# Altium project power_board.PrjPcb
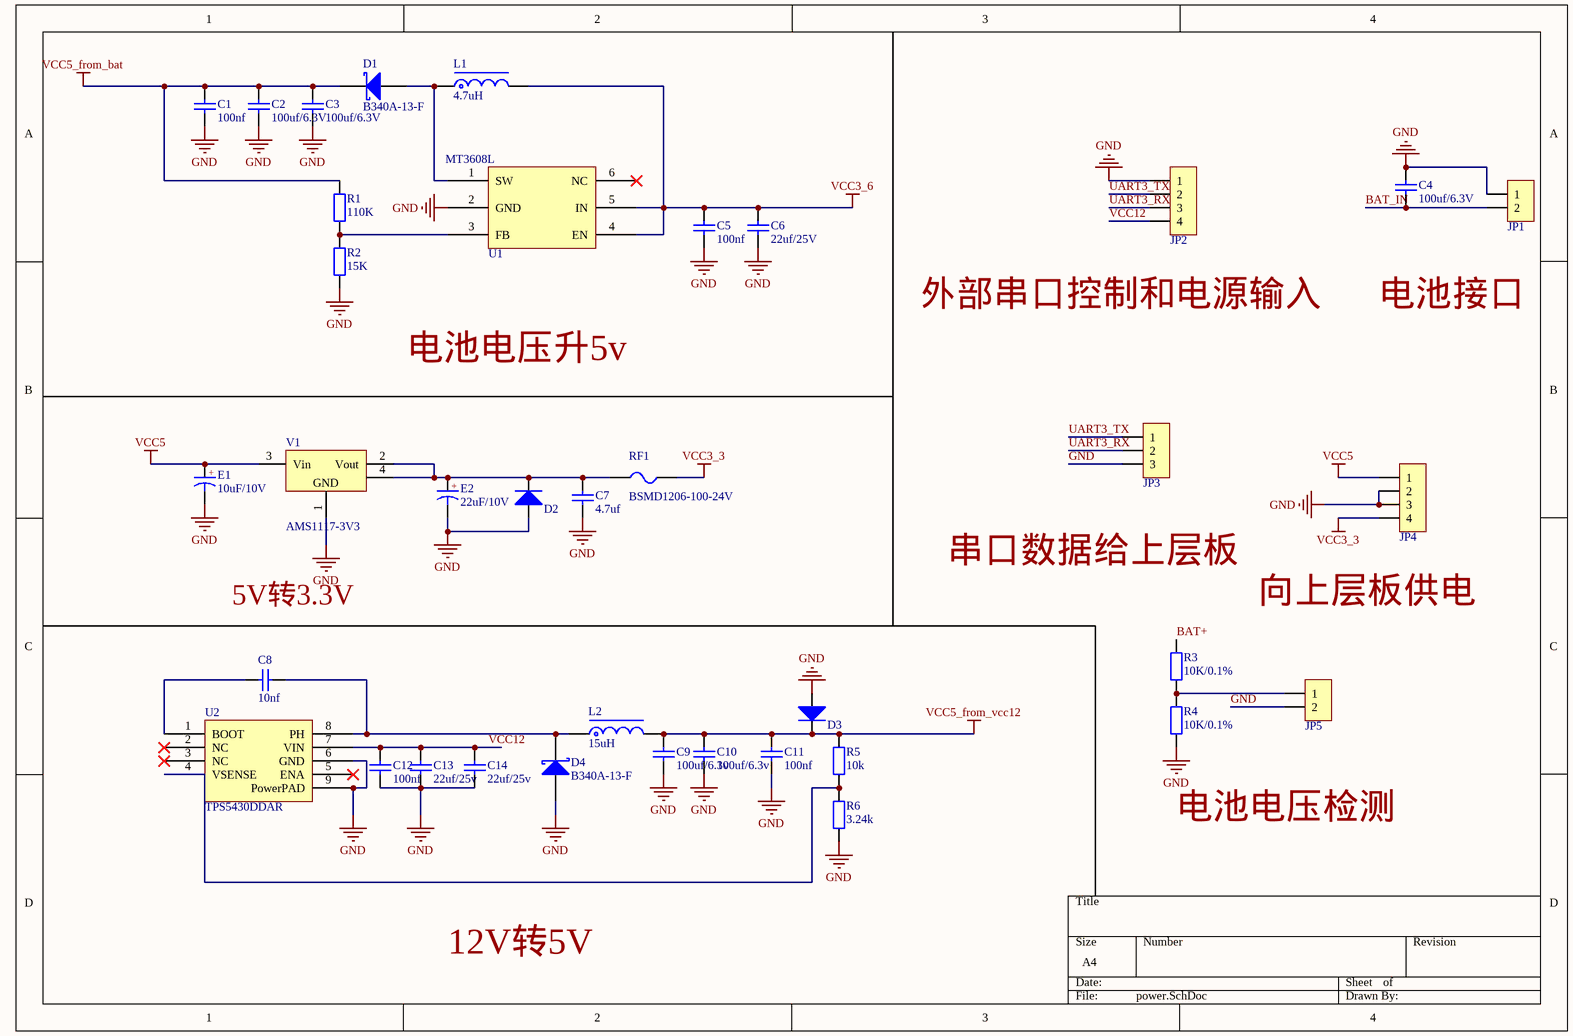
[diagram p0: power.SchDoc]
2 sheets, 73 parts. Net scope: global (net labels, ports and power ports of the same name join across sheets).
Board file: power.PcbDoc
Sheets:
  power.SchDoc
  power2.SchDoc

## Sheet power.SchDoc
size A4; SheetNumber: 1; SheetTotal: 2

### Parts
C1  100nf  [C0603_L]
C2  100uf/6.3V  [C1206_L]
C3  100uf/6.3V  [C1206_L]
C4  100uf/6.3V  [C1206_L]
C5  100nf  [C0603_L]
C6  22uf/25V  [C1206_L]
C7  4.7uf  [C0603_M]
C8  10nf  [C0603_L]
C9  100uf/6.3v  [C1206_L]
C10  100uf/6.3v  [C1206_L]
C11  100nf  [C0603_L]
C12  100nf  [C0603_L]
C13  22uf/25v  [C1206_L]
C14  22uf/25v  [C1206_L]
D1  B340A-13-F  [SMA]
D2  UDD32C03L01  [SOD-323]  (value not drawn)
D3  SMF5.0A  [SOD-123]  (value not drawn)
D4  B340A-13-F  [SMA]
E1  10uF/10V  [C_3216]
E2  22uF/10V  [C_3216]
JP1  HDR-1X2  [PH2.0-W-2P]  (value not drawn)
JP2  HDR-1X4  [PH2.0-W-4P]  (value not drawn)
JP3  HDR-1X3  [HDR2.54-LI-3P]  (value not drawn)
JP4  HDR-1X4  [HDR2.54-LI-4P]  (value not drawn)
JP5  HDR-1X2  [HDR2.54-LI-2P]  (value not drawn)
L1  4.7uH  [CD53]
L2  15uH  [CD75]
R1  110K  [R0603_L]
R2  15K  [R0603_L]
R3  10K/0.1%  [R0603_L]
R4  10K/0.1%  [R0603_L]
R5  10k  [R0603_L]
R6  3.24k  [R0603_L]
RF1  BSMD1206-100-24V  [F1206]
U1  MT3608L  [SOT23-6M]
U2  TPS5430DDAR  [SOIC-8_EP]
V1  AMS1117-3V3  [SOT223_L]

### Nets
GND: C1.1 C2.1 C3.1 C4.2 C5.1 C6.1 C7.2 C9.1 C10.1 C11.1 C12.1 C13.1 C14.1 D2.1(A) D3.1(A) D4.1(A) E1.2(K) E2.2(K) JP1.1 JP2.1 JP3.3 JP4.2 JP4.3 JP5.2 R2.1 R4.1 R6.1 U1.2(GND) U2.6(GND) U2.9(PowerPAD) V1.1(GND)
VCC3_3: JP4.4 RF1.1
VCC3_6: C5.2 C6.2 L1.2 U1.4(EN) U1.5(IN)
VCC5: E1.1(A) JP4.1 V1.3(Vin)
VCC5_from_bat: C1.2 C2.2 C3.2 D1.2(K) R1.2
VCC5_from_vcc12: C9.2 C10.2 C11.2 D3.2(K) L2.2 R5.2
VCC12: C12.2 C13.2 C14.2 JP2.4 U2.7(VIN)
BAT+: R3.2
BAT_IN: C4.1 JP1.2
UART3_RX: JP2.3 JP3.2
UART3_TX: JP2.2 JP3.1
NetC7_1: C7.1 D2.2(K) E2.1(A) RF1.2 V1.2(Vout) V1.4(GND)
NetC8_1: C8.1 U2.1(BOOT)
NetC8_2: C8.2 D4.2(K) L2.1 U2.8(PH)
NetD1_1: D1.1(A) L1.1 U1.1(SW)
NetJP5_1: JP5.1 R3.1 R4.2
NetR1_1: R1.1 R2.2 U1.3(FB)
NetR5_1: R5.1 R6.2 U2.4(VSENSE)

Not connected (* = marked no-connect by the designer): U1 6(NC)*; U2 2(NC)* 3(NC)* 5(ENA)*

### Notes on the sheet
- 外部串口控制和电源输入
- 电池接口
- 电池电压升5v
- 串口数据给上层板
- 5V转3.3V
- 向上层板供电
- 电池电压检测
- 12V转5V
- (in symbol CT) +

### Library data of the parts
C1-C6 = C: 贴片电容/MLCC电容; BOM名称: 无极性贴片电容
  C2-C4: jlc_id: C15008
C7 C8 C11-C13 = C: 贴片电容/MLCC电容; BOM名称: 无极性贴片电容; 联系下单店铺卖家 免费帮你查找封装: 联系下单店铺卖家 免费技术指导
C9 C10 = C: 贴片电容/MLCC电容 C15008; BOM名称: 无极性贴片电容; 联系下单店铺卖家 免费帮你查找封装: 联系下单店铺卖家 免费技术指导
C14 = C: 贴片电容/MLCC电容 C12891; BOM名称: 无极性贴片电容; 联系下单店铺卖家 免费帮你查找封装: 联系下单店铺卖家 免费技术指导
D1 = B340A-13-F: 肖特基二极管 C85098; 属性: 60V/5A; BOM名称: 肖特基二极管
D2 = TVS: TVS通用 C78439; 当前库版本V2024.3.30 @淘宝卖家:黄晶宝石: 最新版本发布https://item.taobao.com/item.htm?id=566775463719
D3 = TVS: TVS通用; 当前库版本V2024.3.30 @淘宝卖家:黄晶宝石: 最新版本发布https://item.taobao.com/item.htm?id=566775463719
D4 = B340A-13-F: 肖特基二极管 C85098; 属性: 60V/5A; 当前库版本V2024.3.30 @淘宝卖家:黄晶宝石: 最新版本发布https://item.taobao.com/item.htm?id=566775463719; BOM名称: 肖特基二极管
E1 = CT: 贴片钽电容 C7171; 联系下单店铺卖家 免费帮你查找封装: 联系下单店铺卖家 免费技术指导; BOM名称: 贴片钽电容
E2 = CT: 贴片钽电容  C11366; 联系下单店铺卖家 免费帮你查找封装: 联系下单店铺卖家 免费技术指导; BOM名称: 贴片钽电容
JP1 = Header 2: 2P接插件; 封装库来自淘宝卖家：黄晶宝石: 获取最新版本https://shop463601444.taobao.com; 联系下单店铺卖家 免费帮你查找封装: 联系下单店铺卖家 免费技术支持; BOM名称: 2P接插件
JP2 = Header 4: 4P接插件; 封装库来自淘宝卖家：黄晶宝石: 获取最新版本https://shop463601444.taobao.com; 联系下单店铺卖家 免费帮你查找封装: 联系下单店铺卖家 免费技术支持
JP3 = Header 3: 3P接插件; 联系卖家，免费查找封装: 唯一出售店铺网址https://shop463601444.taobao.com; 封装库来自淘宝卖家ID：黄晶宝石: 其他店铺购入均为盗版封装库，请立即申请退款，本店现金奖励50~200元; BOM名称: 3P接插件
JP4 = Header 4: 4P接插件; 联系卖家，免费查找封装: 唯一出售店铺网址https://shop463601444.taobao.com; 封装库来自淘宝卖家ID：黄晶宝石: 其他店铺购入均为盗版封装库，请立即申请退款，本店现金奖励50~200元; BOM名称: 4P接插件
JP5 = Header 2: 2P接插件; 联系卖家，免费查找封装: 唯一出售店铺网址https://shop463601444.taobao.com; 封装库来自淘宝卖家ID：黄晶宝石: 其他店铺购入均为盗版封装库，请立即申请退款，本店现金奖励50~200元; BOM名称: 2P接插件
L1 L2 = L-SMD: CD系列贴片线绕功率电感; BOM名称: 功率电感
  L1: jlc_id: C177246
  L2: jlc_id: C177243
R1-R6 = R: 贴片电阻; 联系下单店铺卖家 免费帮你查找封装: 联系下单店铺卖家 免费技术指导; BOM名称: 贴片电阻
RF1 = FUSE-PPTC: PPTC自恢复保险丝 C910830; 当前库版本V2024.3.30 @淘宝卖家:黄晶宝石: 最新版本发布https://item.taobao.com/item.htm?id=566775463719; BOM名称: PPTC自恢复保险丝
U1 = MT3608L: Boost升压DC-DC芯片 2-28V
U2 = TPS5430DDAR: 5.5v到36v转1.3v到32v
V1 = AMS1117: 三端稳压芯片; BOM名称: 稳压芯片; 联系下单店铺卖家 免费帮你查找封装: 联系下单店铺卖家 免费技术支持; 当前库版本V2024.3.30 @淘宝卖家:黄晶宝石: 最新版本发布https://item.taobao.com/item.htm?id=566775463719

## Sheet power2.SchDoc
size A4; SheetNumber: 2; SheetTotal: 2
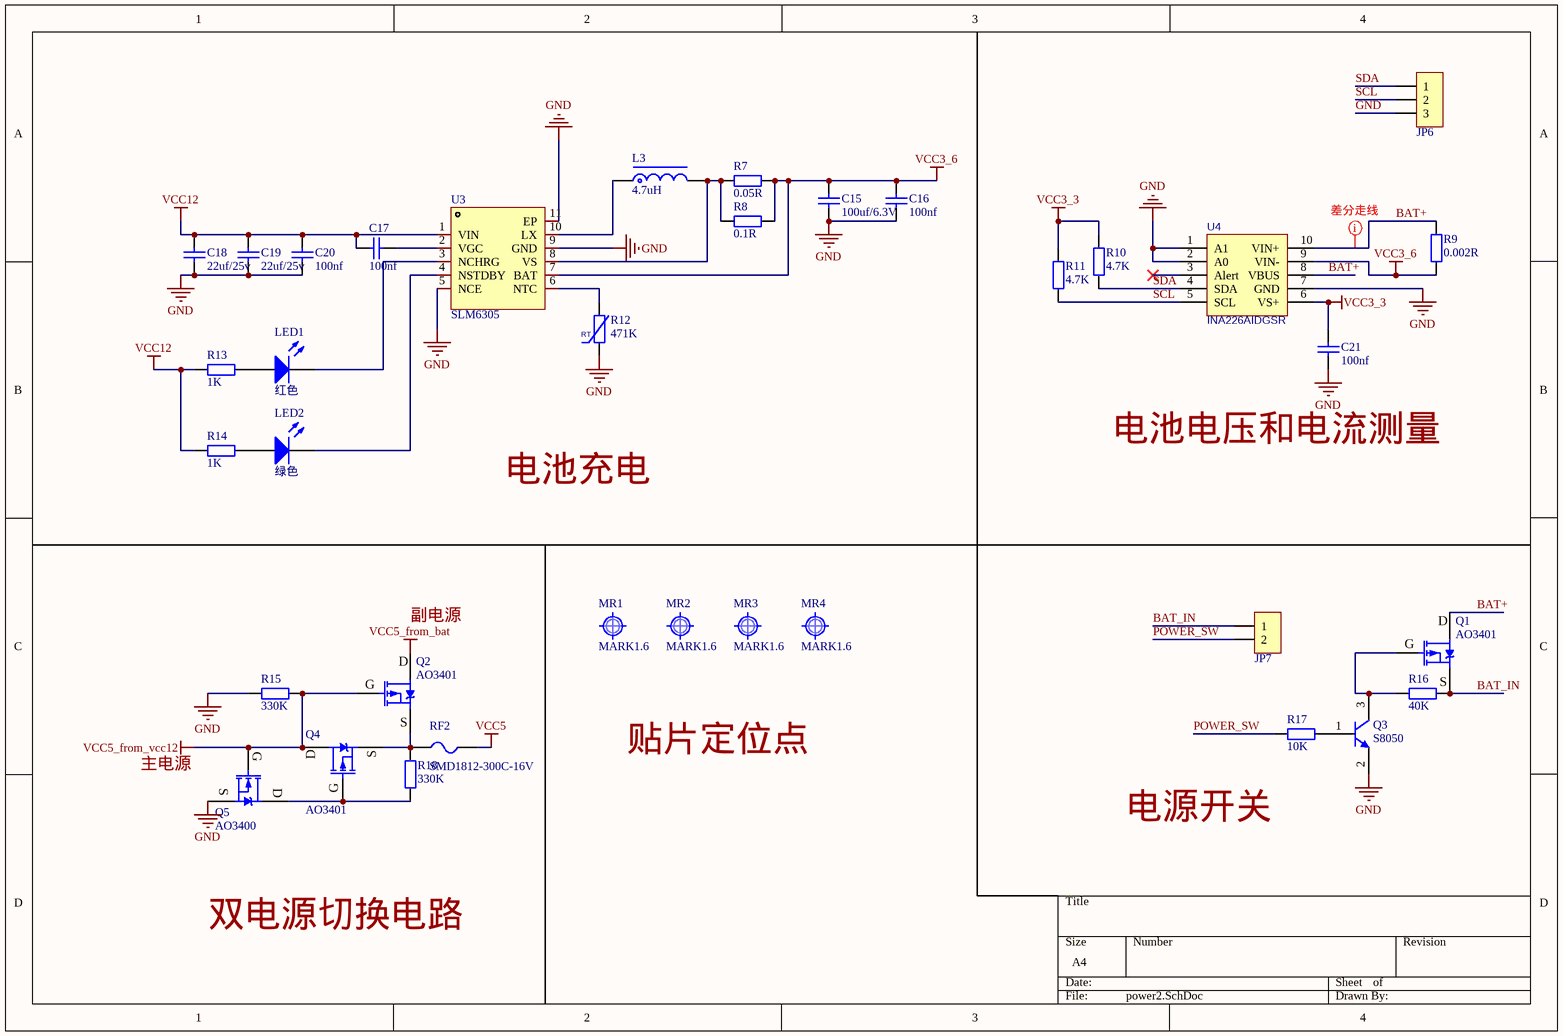
[diagram p1: power2.SchDoc]

### Parts
C15  100uf/6.3V  [C1206_L]
C16  100nf  [C0603_L]
C17  100nf  [C0603_L]
C18  22uf/25v  [C0805_L]
C19  22uf/25v  [C0805_L]
C20  100nf  [C0603_L]
C21  100nf  [C0603_L]
JP6  HDR-1X3  [HDR2.54-LI-3P]  (value not drawn)
JP7  HDR-1X2  [PH2.0-W-2P]  (value not drawn)
L3  4.7uH  [CD53]
LED1  红色  [LED0603_Y]
LED2  绿色  [LED0603_Y]
MR1  MARK1.6  [Mark 1]
MR2  MARK1.6  [Mark 1]
MR3  MARK1.6  [Mark 1]
MR4  MARK1.6  [Mark 1]
Q1  AO3401  [SOT23-3N]
Q2  AO3401  [SOT23-3N]
Q3  S8050  [SOT23-3M]
Q4  AO3401  [SOT23-3N]
Q5  AO3400  [SOT23-3N]
R7  0.05R  [R1206_L]
R8  0.1R  [R1206_L]
R9  0.002R  [R2512_M]
R10  4.7K  [R0603_L]
R11  4.7K  [R0603_L]
R12  471K  [PK0406]
R13  1K  [R0603_L]
R14  1K  [R0603_L]
R15  330K  [R0603_L]
R16  40K  [R0603_L]
R17  10K  [R0603_L]
R18  330K  [R0603_L]
RF2  SMD1812-300C-16V  [F1812]
U3  SLM6305  [DFN10-L3.0-W3.0-P0.5_EP]
U4  INA226AIDGSR  [MSOP10_N]

### Nets
GND: C15.1 C16.1 C18.1 C19.1 C20.2 C21.1 JP6.3 Q3.2(E) Q5.2(S) R12.1 R15.2 U3.5(NCE) U3.9(GND) U3.11(EP) U4.1(A1) U4.2(A0) U4.7(GND)
VCC3_3: C21.2 R10.2 R11.2 U4.6(VS+)
VCC3_6: C15.2 C16.2 R7.2 R8.2 R9.2 U3.7(BAT) U4.9(VIN-)
VCC5: RF2.1
VCC5_from_bat: Q2.3(D)
VCC5_from_vcc12: Q2.1(G) Q4.3(D) Q5.1(G) R15.1
VCC12: C17.2 C18.2 C19.2 C20.1 R13.1 R14.1 U3.1(VIN)
BAT+: Q1.3(D) R9.1 U4.8(VBUS) U4.10(VIN+)
BAT_IN: JP7.1 Q1.2(S) R16.2
POWER_SW: JP7.2 R17.1
SCL: JP6.2 R11.1 U4.5(SCL)
SDA: JP6.1 R10.1 U4.4(SDA)
NetC17_1: C17.1 U3.2(VGC)
NetL3_1: L3.1 U3.10(LX)
NetL3_2: L3.2 R7.1 R8.1 U3.8(VS)
NetLED1_1: LED1.1(A) R13.2
NetLED1_2: LED1.2(K) U3.3(NCHRG)
NetLED2_1: LED2.1(A) R14.2
NetLED2_2: LED2.2(K) U3.4(NSTDBY)
NetQ1_1: Q1.1(G) Q3.3(C) R16.1
NetQ2_2: Q2.2(S) Q4.2(S) R18.2 RF2.2
NetQ3_1: Q3.1(B) R17.2
NetQ4_1: Q4.1(G) Q5.3(D) R18.1
NetR12_2: R12.2 U3.6(NTC)

Not connected (* = marked no-connect by the designer): U4 3(Alert)*

### Layout directives
mark named 差分走线: BAT+

### Notes on the sheet
- 电池电压和电流测量
- 电池充电
- 副电源
- 主电源
- 贴片定位点
- 电源开关
- 双电源切换电路

### Library data of the parts
C15-C21 = C: as C7 on sheet power
  C15 C18 C19: jlc_id: C45783
JP6 = Header 3: as JP3 on sheet power; BOM名称: 3P接插件
JP7 = Header 2: as JP1 on sheet power; BOM名称: 2P接插件
L3 = L-SMD: CD系列贴片线绕功率电感; BOM名称: 功率电感; jlc_id: C177246
LED1 LED2 = LED: 贴片LED; 封装库来自淘宝卖家：黄晶宝石: 其他店铺购入均为盗版封装库，无更新权益，请立即申请退款，本店现金奖励200~1000元; BOM名称: 贴片LED
MR1-MR4 = MARK: 光学定位点; 联系下单店铺卖家 免费技术支持: 联系下单店铺卖家 免费帮你查找封装; BOM名称: 光学定位点
Q1 Q2 Q4 = AO3401: P沟道 30V/4.2A; BOM名称: 场效应管; 联系下单店铺卖家 免费帮你查找封装: 联系下单店铺卖家 免费技术支持; 当前库版本V2024.2.3 @淘宝卖家:黄晶宝石: 最新版本发布https://item.taobao.com/item.htm?id=566775463719; 参数: P沟道 30V/4.2A; jlc_id: C347476
Q3 = BCP68: NPN三极管; 联系下单店铺卖家 免费帮你查找封装: 联系下单店铺卖家 免费技术支持; 当前库版本V2024.2.3 @淘宝卖家:黄晶宝石: 最新版本发布https://item.taobao.com/item.htm?id=566775463719
Q5 = AO3400: N沟道 30V/4.2A; BOM名称: 场效应管; 联系下单店铺卖家 免费帮你查找封装: 联系下单店铺卖家 免费技术支持; 当前库版本V2024.2.3 @淘宝卖家:黄晶宝石: 最新版本发布https://item.taobao.com/item.htm?id=566775463719; 参数: N沟道 30V/4.2A; jlc_id: C20917
R7-R11 R13-R18 = R: 贴片电阻; 联系下单店铺卖家 免费帮你查找封装: 联系下单店铺卖家 免费技术指导; BOM名称: 贴片电阻
  R7: jlc_id: C127691
  R8: jlc_id: C25334
  R9: jlc_id: C2994640
R12 = RT: 热敏电阻; BOM名称: 压敏电阻; 当前库版本V2024.3.30 @淘宝卖家:黄晶宝石: 最新版本发布https://item.taobao.com/item.htm?id=566775463719
RF2 = FUSE-PPTC: PPTC自恢复保险丝; 当前库版本V2024.3.30 @淘宝卖家:黄晶宝石: 最新版本发布https://item.taobao.com/item.htm?id=566775463719; BOM名称: PPTC自恢复保险丝; jlc_id: C2760295
U3 = SLM6305: 1锂电池充电ic 2.5a 4.2v 4V~26V输入; Manufacturer: 无锡松朗微; Add into BOM: yes; The Chip Type: 降压充电芯片; Supply Voltage: 4V~26V; Type of Battery: 锂离子/聚合物; Number of Cells: 1; Symbol: SLM6305; Device: SLM6305; Supplier: LCSC; jlc_id: C711584; Manufacturer Part: SLM6305; JLCPCB Part Class: 扩展库; LCSC Part Name: 宽输入电压2.5A单节锂电池充电管理IC; Supplier Footprint: TDFN-10-EP(3x3); Datasheet: https://atta.szlcsc.com/upload/public/pdf/source/20200723/C711584_2224278DBAF55B7B34A102BEBD70C238.pdf; Convert to PCB: yes; Maximum Charge Current: 2.5A; Charging Saturation Voltage: 4.2V; Operating Temperature: -40℃~+85℃
U4 = INA226: 双向电流/功率监视器芯片; 封装库来自淘宝卖家：黄晶宝石: 其他店铺购入均为盗版封装库，无更新权益，请立即申请退款，联系卖家：黄晶宝石 获取现金奖励200~5000元

## Nets that join several sheets
GND: power (31 pins), power2 (17 pins)
VCC3_3: power (JP4.4 RF1.1), power2 (C21.2 R10.2 R11.2 U4.6)
VCC3_6: power (5 pins), power2 (7 pins)
VCC5: power (E1.1 JP4.1 V1.3), power2 (RF2.1)
VCC5_from_bat: power (5 pins), power2 (Q2.3)
VCC5_from_vcc12: power (6 pins), power2 (Q2.1 Q4.3 Q5.1 R15.1)
VCC12: power (5 pins), power2 (7 pins)
BAT+: power (R3.2), power2 (Q1.3 R9.1 U4.8 U4.10)
BAT_IN: power (C4.1 JP1.2), power2 (JP7.1 Q1.2 R16.2)